# Altium schematic sheet Motorvezérlő.SchDoc
size A4
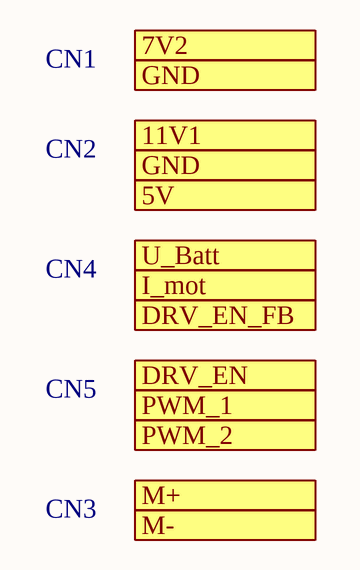
[diagram p0: Motorvezérlő.SchDoc]

## Ports
5V (out), 7V2 (in), 11V1 (in), DRV_EN (in), DRV_EN_FB (out), GND (in), I_mot (out), M+ (out), M- (out), PWM_1 (in), PWM_2 (in), U_Batt (out)

## Notes on the sheet
- CN1
- CN2
- CN4
- CN5
- CN3